# Altium schematic sheet BD.SchDoc: TEBF0808 - Block Diagram
size A4; PageSetup: Record=PageOptions|CenterHorizontal=True|CenterVertical=True|PrintScale=0.92|XCorrection=1.00|YCorrection=1.00|PrintKind=0|BorderSize=5000000|LeftOffset=0|BottomOffset=0|Orientation=2|PaperLength=1000|PaperWidth=1000|Scale=100|PaperSource=7|PrintQuality=-4|MediaType=1|DitherType=10|PrintScaleMode=1|PaperKind=A4; Organization: Trenz Electronic GmbH; DocumentNumber: TEBF0808; Revision: 04; SheetNumber: 35; SheetTotal: 36; Date: 2016-09-29; CompanyName: Trenz Electronic GmbH
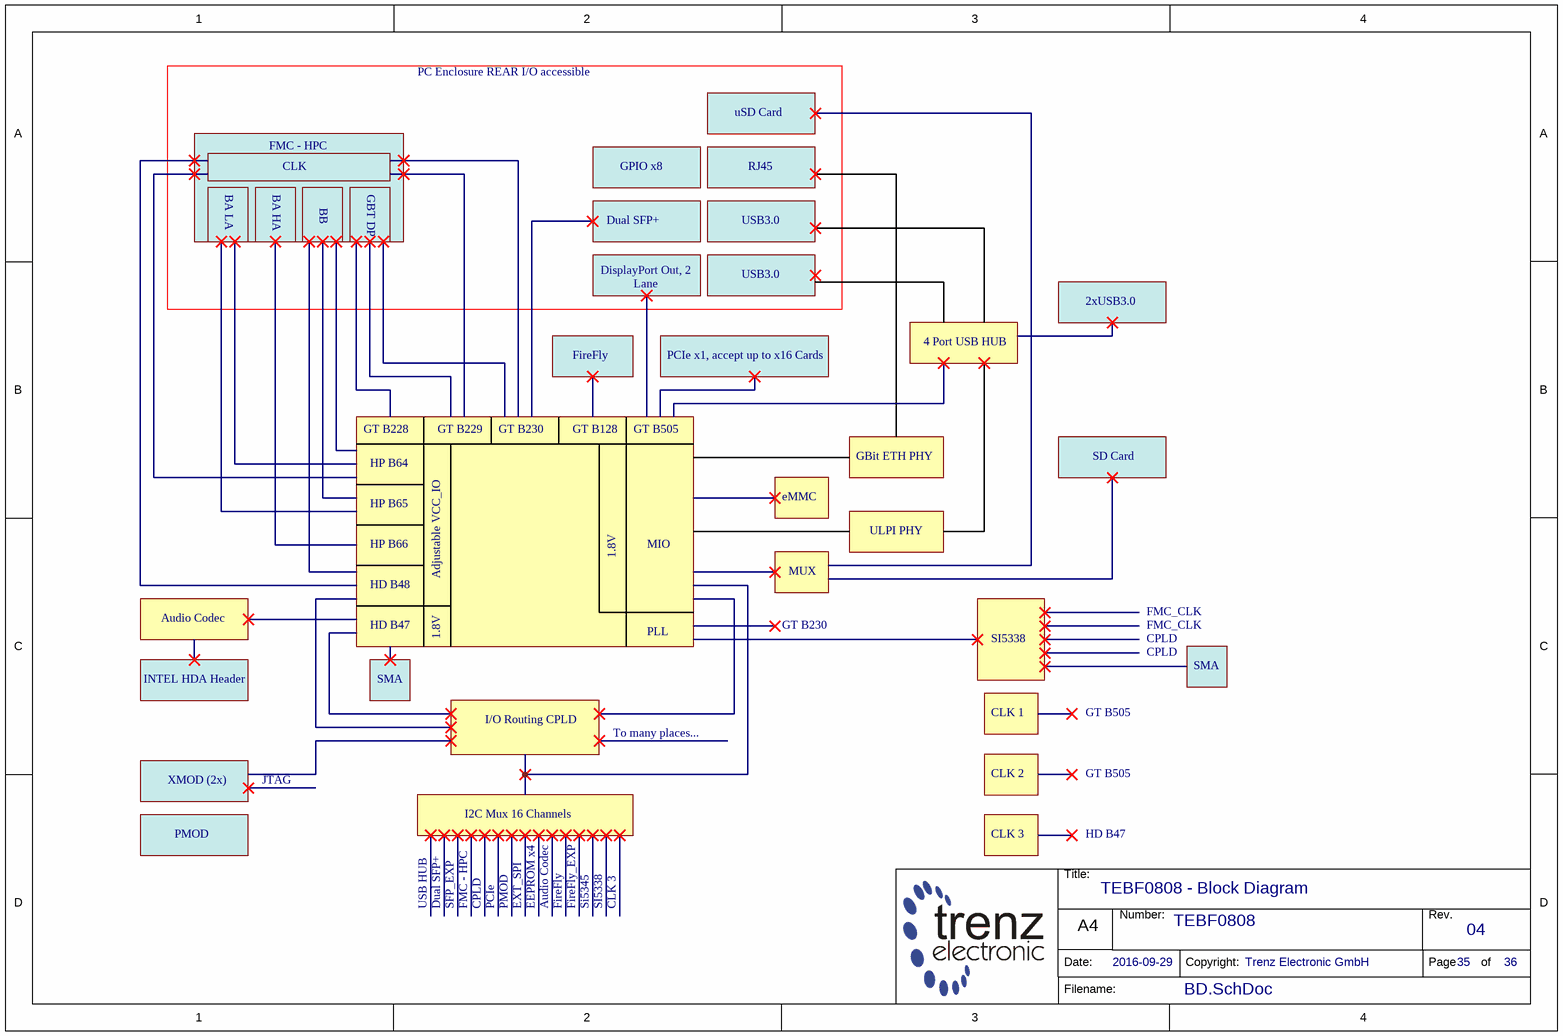
[diagram p0: BD.SchDoc]

## Notes on the sheet
- PC Enclosure REAR I/O accessible
- uSD Card
- FMC - HPC
- CLK
- GPIO x8
- RJ45
- BA LA
- BA HA
- BB
- GBT DP
- Dual SFP+
- USB3.0
- DisplayPort Out, 2 Lane
- 2xUSB3.0
- FireFly
- PCIe x1, accept up to x16 Cards
- 4 Port USB HUB
- GT B228
- GT B229
- GT B230
- GT B128
- GT B505
- HP B64
- HP B65
- eMMC
- GBit ETH PHY
- SD Card
- HP B66
- Adjustable VCC_IO
- 1.8V
- MIO
- MUX
- ULPI PHY
- Audio Codec
- HD B48
- HD B47
- PLL
- SI5338
- FMC_CLK
- CPLD
- INTEL HDA Header
- SMA
- CLK 1
- XMOD (2x)
- JTAG
- I/O Routing CPLD
- To many places...
- CLK 2
- PMOD
- I2C Mux 16 Channels
- CLK 3
- USB HUB
- SFP_EXP
- PCIe
- EXT_SPI
- EEPROM x4
- FireFly_EXP
- Si5345
- Title:
- Number:
- Rev.
- Date:
- A4
- Copyright:
- Page
- of
- Filename: